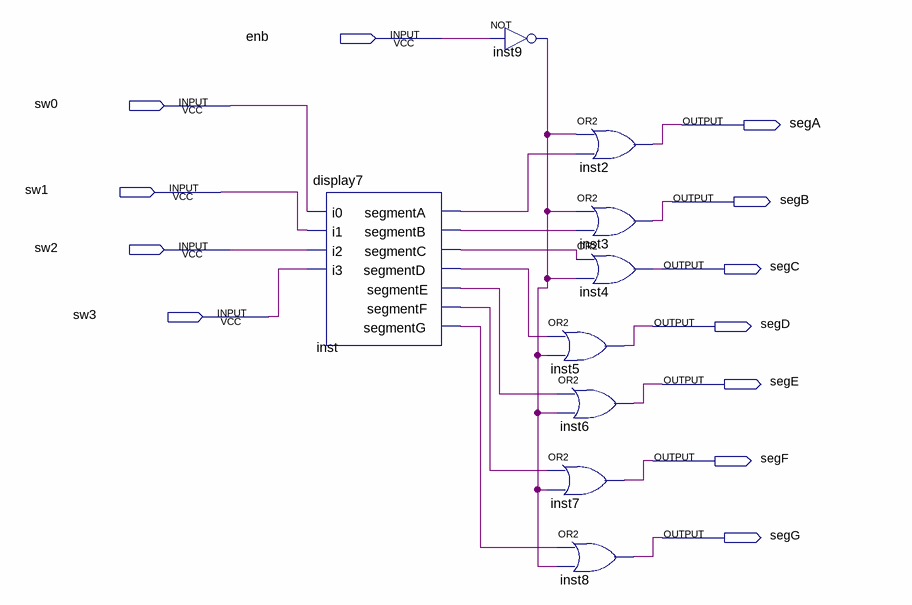
[diagram p0: schematic sheet]
// Quartus schematic display7_en.bdf as structural Verilog: 9 symbols, 12 pins
module display7_en (
  input  enb,
  input  sw0,
  input  sw1,
  input  sw2,
  input  sw3,
  output segA,
  output segB,
  output segC,
  output segD,
  output segE,
  output segF,
  output segG
);

  wire inst9_out, inst_segmenta, inst_segmentb, inst_segmentc, inst_segmentd, inst_segmente, inst_segmentf,
       inst_segmentg;

  display7 inst (
    .i0(sw0), .i1(sw1), .i2(sw2), .i3(sw3), .segmentA(inst_segmenta), .segmentB(inst_segmentb),
    .segmentC(inst_segmentc), .segmentD(inst_segmentd), .segmentE(inst_segmente), .segmentF(inst_segmentf),
    .segmentG(inst_segmentg));
  not inst9 (inst9_out, enb);
  or inst2 (segA, inst9_out, inst_segmenta);
  or inst3 (segB, inst9_out, inst_segmentb);
  or inst4 (segC, inst_segmentc, inst9_out);
  or inst5 (segD, inst_segmentd, inst9_out);
  or inst6 (segE, inst_segmente, inst9_out);
  or inst7 (segF, inst_segmentf, inst9_out);
  or inst8 (segG, inst_segmentg, inst9_out);
endmodule
